# EAGLE board EEZ DIB AFE3 r1B4 (EAGLE 7.2.0)
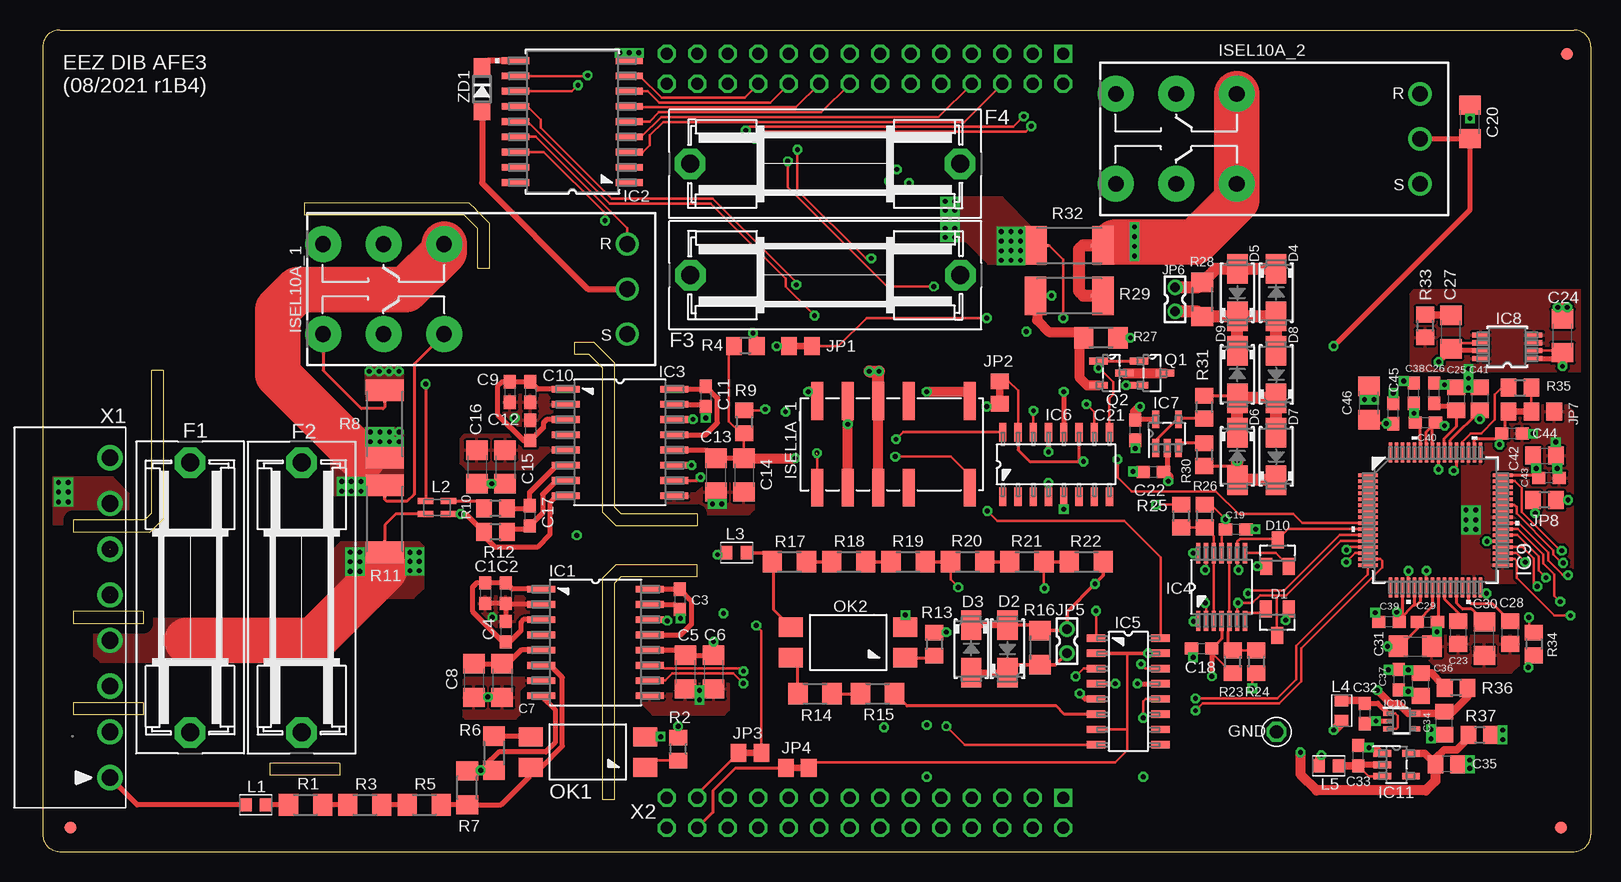
[diagram p4: board, top side]
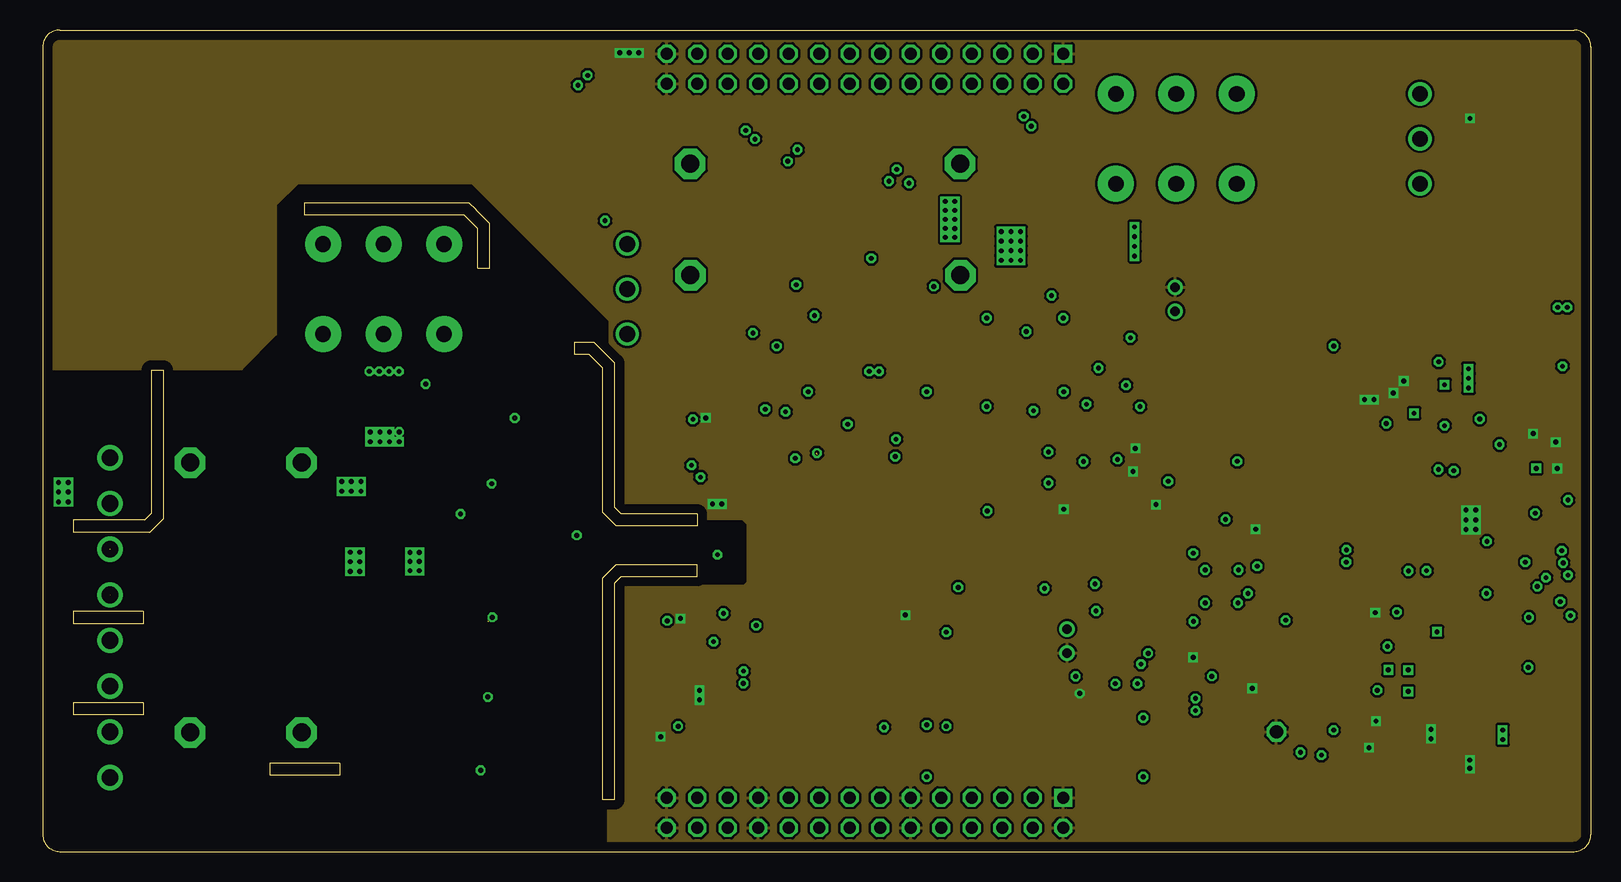
[diagram p5: board, inner layer Gnd]
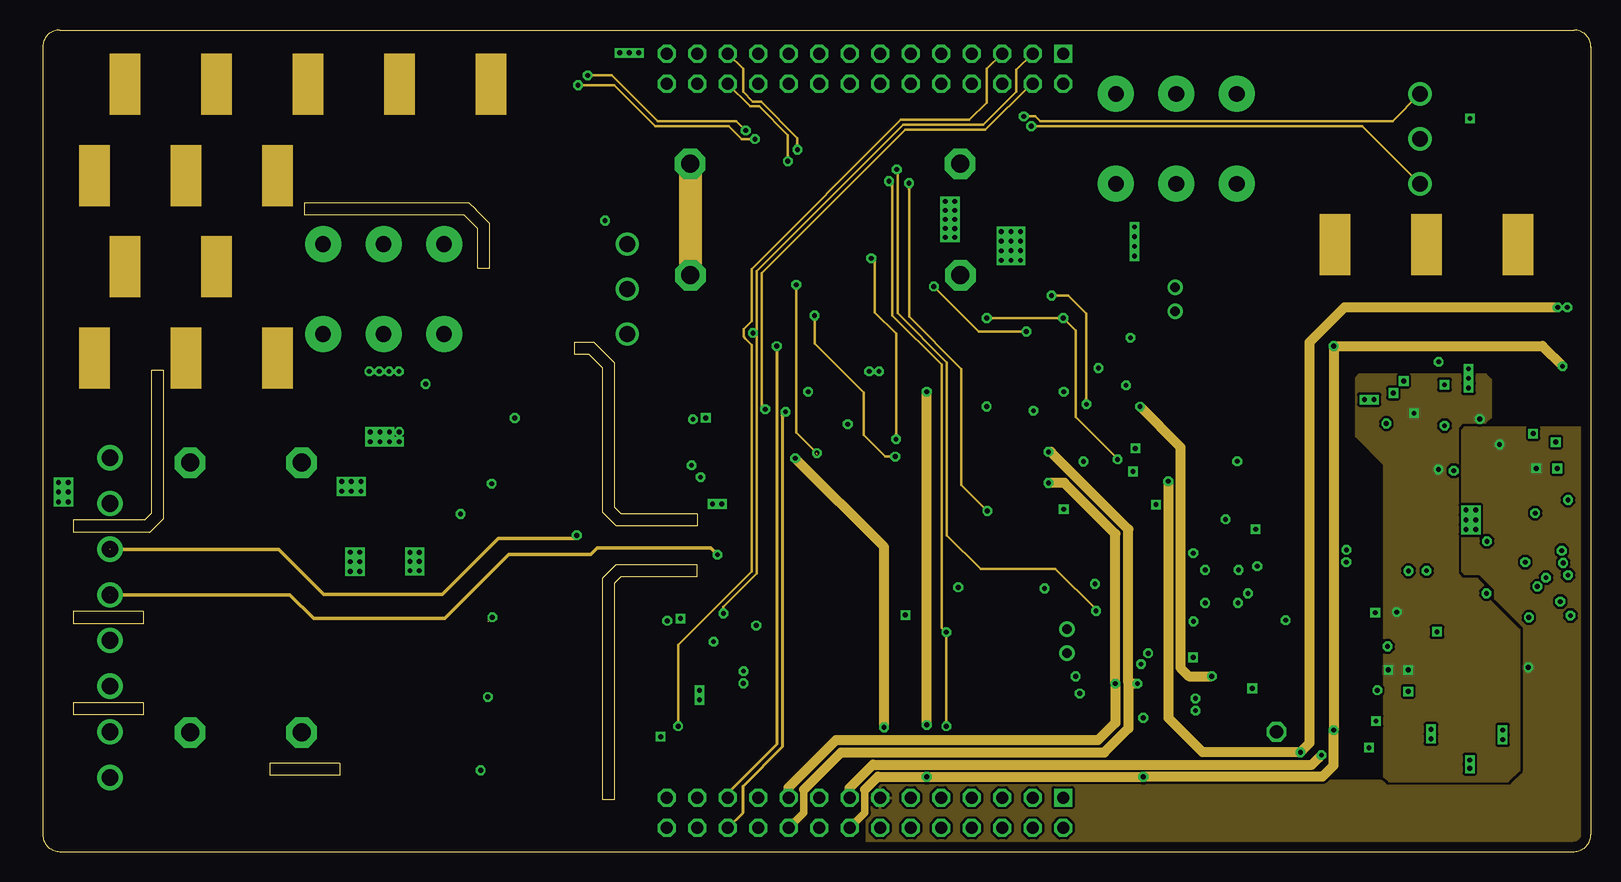
[diagram p6: board, inner layer Power]
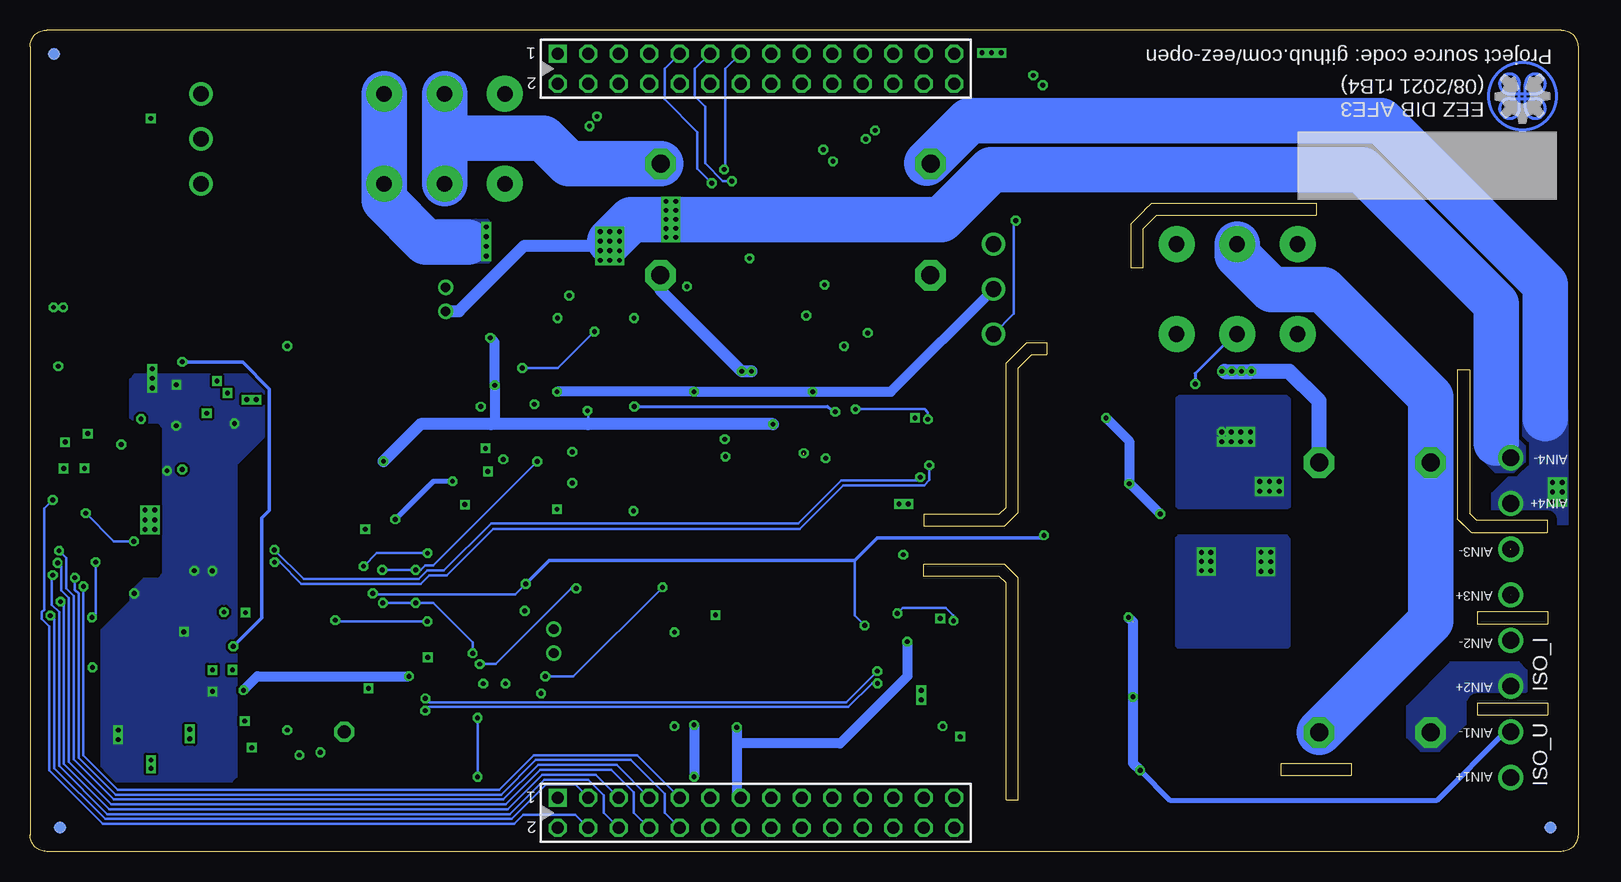
[diagram p7: board, bottom side, seen from below]

Size 129 x 68.5 mm. Coordinates in mm from the lower left corner, seen from the top.
Outline: 36.11,53.5 35.53,54.07 21.81,54.07 21.81,53.06 35.1,53.06 36.23,51.93 36.23,48.66 37.25,48.66 37.25,52.36 36.12,53.49
Outline: 46.52,41.87 45.95,42.44 44.28,42.44 44.28,41.42 45.52,41.42 46.65,40.29 46.65,28.27 47.78,27.14 54.53,27.14 54.53,28.15 48.21,28.15 47.66,28.7 47.66,40.73 46.53,41.86
Outline: 9.28,26.98 9.83,27.53
Outline: 0,67.1 0,1.4 arc90 1.4,0 127.6,0 arc90 129,1.4 129,67.1 arc90 127.6,68.5 1.4,68.5 arc90 0,67.1
Outline: 8.38,20.01 2.54,20.01 2.54,19 8.38,19 8.38,20.01
Outline: 8.38,12.4 2.54,12.4 2.54,11.39 8.38,11.39 8.38,12.4
Outline: 9.03,40.14 9.03,28.18 8.48,27.63 2.55,27.63 2.55,26.62 8.91,26.62 10.05,27.75 10.05,40.14 9.03,40.14
Outline: 48.21,22.93 54.53,22.93 54.53,23.95 47.78,23.95 46.65,22.82 46.65,4.3 47.66,4.3 47.66,22.39 48.21,22.93
Outline: 24.75,7.35 18.91,7.35 18.91,6.33 24.75,6.33 24.75,7.35
Copper layers (1+2+15+16): Top 0.035559375mm / dielectric 7mil / Gnd 0.03048125mm / dielectric 44mil / Power 0.03048125mm / dielectric 7mil / Bottom 0.035559375mm
Design rules "DIB 4-layer *": minimum track width 6mil, minimum drill 0.3mm, track to track 4mil, track to pad 4mil, pad to pad 4mil, via to via 4mil, smd to smd 4mil, copper to edge 30mil, drill to drill 8mil, minimum pad ring 4mil, minimum via ring 8mil, stop-mask expansion 2.5mil, vias tented up to drill 0.6mm, thermal gap 8mil
Net classes: 0 default: width 0.152 mm, drill 0.3 mm, clearance 0.152 mm; 1 lvds: width 0.152 mm, drill 0.3 mm, clearance 0.152 mm to class 0, clearance 0.152 mm; 2 gnd: width 0.254 mm, drill 0.584 mm, clearance 0.254 mm; 3 diff_in: width 0.254 mm, drill 0.584 mm, clearance 0.203 mm to class 0, clearance 0.203 mm to class 1, clearance 0.203 mm to class 2, clearance 0.203 mm
vRestrict: area 0,34.5 to 21,68.5

## Footprints (pad centres in the part's own frame; a part is rotated, then mirrored left to right if it is on the bottom)
C0603 = smd 1.1 x 1: 1 -0.85,0; 2 0.85,0
C1206 = smd 1.6 x 1.8: 1 -1.4,0; 2 1.4,0
C0805 = smd 1.3 x 1.5: 1 -0.95,0; 2 0.95,0
SOT23 = smd 1 x 1.4: 1 -0.95,-1.1; 2 0.95,-1.1; 3 0,1.1
SMA_NARROW = smd 2.464 x 1.702: 1 -1.981,0; 2 1.981,0
ZH32 = drill 1.5 pad 2.54 octagon: 1 -11.25,0; 2 11.25,0
FIDUCIAL_DUAL = smd 1.016 x 1.016 bottom: B 0,0 | smd 1.016 x 1.016: T 0,0
PCB_SHIELD_TAB = drill 1.1 octagon: 1 0,0
DW16 = smd 2.311 x 0.559: 1 -4.521,4.445; 2 -4.521,3.175; 3 -4.521,1.905; 4 -4.521,0.635; 5 -4.521,-0.635; 6 -4.521,-1.905; 7 -4.521,-3.175; 8 -4.521,-4.445; 9 4.521,-4.445; 10 4.521,-3.175; 11 4.521,-1.905; 12 4.521,-0.635; 13 4.521,0.635; 14 4.521,1.905; 15 4.521,3.175; 16 4.521,4.445
DW18_TEX-M = smd 2.286 x 0.559: 1 -4.737,5.08; 2 -4.737,3.81; 3 -4.737,2.54; 4 -4.737,1.27; 5 -4.737,0; 6 -4.737,-1.27; 7 -4.737,-2.54; 8 -4.737,-3.81; 9 -4.737,-5.08; 10 4.737,-5.08; 11 4.737,-3.81; 12 4.737,-2.54; 13 4.737,-1.27; 14 4.737,0; 15 4.737,1.27; 16 4.737,2.54; 17 4.737,3.81; 18 4.737,5.08
PW(R-PDSO-G14) = smd 1.676 x 0.356: 1 -2.819,1.95; 2 -2.819,1.3; 3 -2.819,0.65; 4 -2.819,0; 5 -2.819,-0.65; 6 -2.819,-1.3; 7 -2.819,-1.95; 8 2.819,-1.95; 9 2.819,-1.3; 10 2.819,-0.65; 11 2.819,0; 12 2.819,0.65; 13 2.819,1.3; 14 2.819,1.95
SO16 = smd 1.549 x 0.61: 1 -2.692,4.445; 2 -2.692,3.175; 3 -2.692,1.905; 4 -2.692,0.635; 5 -2.692,-0.635; 6 -2.692,-1.905; 7 -2.692,-3.175; 8 -2.692,-4.445; 9 2.692,-4.445; 10 2.692,-3.175; 11 2.692,-1.905; 12 2.692,-0.635; 13 2.692,0.635; 14 2.692,1.905; 15 2.692,3.175; 16 2.692,4.445
DBV5 = smd 1.473 x 0.559: 1 -1.194,0.95; 2 -1.194,0; 3 -1.194,-0.95; 4 1.194,-0.95; 5 1.194,0.95
MSOP-8_MS_LIT = smd 1.359 x 0.432: 1 -2.229,0.975; 2 -2.229,0.325; 3 -2.229,-0.325; 4 -2.229,-0.975; 5 2.229,-0.975; 6 2.229,-0.325; 7 2.229,0.325; 8 2.229,0.975
PAG64 = smd 1.664 x 0.279: 1 -5.62,3.75; 2 -5.62,3.25; 3 -5.62,2.75; 4 -5.62,2.25; 5 -5.62,1.75; 6 -5.62,1.25; 7 -5.62,0.75; 8 -5.62,0.25; 9 -5.62,-0.25; 10 -5.62,-0.75; 11 -5.62,-1.25; 12 -5.62,-1.75; 13 -5.62,-2.25; 14 -5.62,-2.75; 15 -5.62,-3.25; 16 -5.62,-3.75; 33 5.62,-3.75; 34 5.62,-3.25; 35 5.62,-2.75; 36 5.62,-2.25; 37 5.62,-1.75; 38 5.62,-1.25; 39 5.62,-0.75; 40 5.62,-0.25; 41 5.62,0.25; 42 5.62,0.75; 43 5.62,1.25; 44 5.62,1.75; 45 5.62,2.25; 46 5.62,2.75; 47 5.62,3.25; 48 5.62,3.75 | smd 0.279 x 1.664: 17 -3.75,-5.62; 18 -3.25,-5.62; 19 -2.75,-5.62; 20 -2.25,-5.62; 21 -1.75,-5.62; 22 -1.25,-5.62; 23 -0.75,-5.62; 24 -0.25,-5.62; 25 0.25,-5.62; 26 0.75,-5.62; 27 1.25,-5.62; 28 1.75,-5.62; 29 2.25,-5.62; 30 2.75,-5.62; 31 3.25,-5.62; 32 3.75,-5.62; 49 3.75,5.62; 50 3.25,5.62; 51 2.75,5.62; 52 2.25,5.62; 53 1.75,5.62; 54 1.25,5.62; 55 0.75,5.62; 56 0.25,5.62; 57 -0.25,5.62; 58 -0.75,5.62; 59 -1.25,5.62; 60 -1.75,5.62; 61 -2.25,5.62; 62 -2.75,5.62; 63 -3.25,5.62; 64 -3.75,5.62
DCK5 = smd 0.85 x 0.4: 1 -1.125,0.65; 2 -1.125,0; 3 -1.125,-0.65; 4 1.125,-0.65; 5 1.125,0.65
G6SK-2F = smd 1 x 3.16: 1 -6.35,-3.62; 3 -1.27,-3.62; 4 1.27,-3.62; 5 3.81,-3.62; 6 6.35,-3.62; 7 6.35,3.62; 8 3.81,3.62; 9 1.27,3.62; 10 -1.27,3.62; 12 -6.35,3.62
RT424FXX = drill 1.3 pad 3: 11 20.3,-3.75; 12 15.26,-3.75; 14 25.34,-3.75; 21 20.3,3.75; 22 15.26,3.75; 24 25.34,3.75 | drill 1.3: A1 0,-3.75; A2 0,3.75; A3 0,0
JP2-0805-NOCUT = smd 1.3 x 1.5: 1 -0.95,0; 2 0.95,0
2MM-2 = drill 0.8 pad 1.27: 1 0,-1; 2 0,1
JP3-0805-CUT2 = smd 1.3 x 1.5: COM 0,0; NC 1.9,0; NO -1.9,0
R_0805 = smd 1.3 x 1.5: 1 -0.95,0; 2 0.95,0
BEAD0603 = smd 1 x 1.1: P$1 -0.85,0; P$2 0.85,0
MURATA_DLW21S = smd 1.3 x 0.5: 1 -0.95,-0.55; 2 0.95,-0.55; 3 0.95,0.55; 4 -0.95,0.55
DIL4-SMD = smd 1.6 x 2: 1 -1.27,-4.77; 2 1.27,-4.77; 3 1.27,4.77; 4 -1.27,4.77
SOT103P240X110-3N = smd 1.524 x 0.559: 1 -1.079,1.016; 2 -1.079,-1.016; 3 1.079,0
R1206 = smd 1.6 x 1.803: 1 -1.422,0; 2 1.422,0
R0805 = smd 1.3 x 1.5: 1 -0.95,0; 2 0.95,0
R_2512-4WIRE = smd 1.8 x 3.2: 1 -2.8,0; 2 2.8,0 | smd 1.27 x 0.254: 1S -2.413,0; 2S 2.413,0
691322310008 = drill 1.4: 1 -13.335,0; 2 -9.525,0; 3 -5.715,0; 4 -1.905,0; 5 1.905,0; 6 5.715,0; 7 9.525,0; 8 13.335,0
TSW-114-07-F-D = drill 1 pad 1.5 square: 1 33.02,0 | drill 1 pad 1.5 octagon: 2 33.02,2.54; 3 30.48,0; 4 30.48,2.54; 5 27.94,0; 6 27.94,2.54; 7 25.4,0; 8 25.4,2.54; 9 22.86,0; 10 22.86,2.54; 11 20.32,0; 12 20.32,2.54; 13 17.78,0; 14 17.78,2.54; 15 15.24,0; 16 15.24,2.54; 17 12.7,0; 18 12.7,2.54; 19 10.16,0; 20 10.16,2.54; 21 7.62,0; 22 7.62,2.54; 23 5.08,0; 24 5.08,2.54; 25 2.54,0; 26 2.54,2.54; 27 0,0; 28 0,2.54
SOD123 = smd 1.4 x 1.4: A 1.9,0; C -1.9,0

## Placement (x,y rotation side)
C1  1u  [C0603]  36.88,21.54 270 top
C2  1n  [C0603]  38.6,21.54 270 top
C3  100n  [C0603]  53.06,21.03 270 top
C4  100n  [C0603]  38.6,18.34 270 top
C5  1n  [C1206]  53.54,14.97 270 top
C6  1u  [C1206]  55.89,14.97 270 top
C7  100n  [C1206]  38.28,14.26 270 top
C8  1n  [C1206]  35.93,14.26 270 top
C9  1u  [C0603]  38.91,38.31 270 top
C10  1n  [C0603]  40.63,38.31 270 top
C11  100n  [C0603]  55.24,37.94 270 top
C12  100n  [C0603]  40.63,35.11 270 top
C13  1n  [C1206]  56.08,31.39 270 top
C14  1u  [C1206]  58.43,31.39 270 top
C15  100n  [C1206]  38.53,32.06 270 top
C16  1n  [C1206]  36.18,32.06 270 top
C17  8n2  [C0603]  40.56,27.99 270 top
C18  100n  [C0603]  96.57,16.93 0 top
C19  100n  [C0603]  99.42,26.86 180 top
C20  10u  [C1206]  118.94,60.83 90 top
C21  100n  [C0603]  91.03,35.14 90 top
C22  100n  [C0603]  92.54,31.66 0 top
C23  1u  [C0805]  117.97,18.26 90 top
C24  N.C.  [C1206]  126.64,43.01 90 top
C25  1u  [C0805]  117.79,37.75 270 top
C26  100n  [C0603]  115.95,38.22 90 top
C27  N.C.  [C1206]  117.35,43.32 90 top
C28  1u  [C0805]  122.29,18.26 90 top
C29  100n  [C0603]  115.38,19.15 0 top
C30  22u  [C1206]  120.13,17.75 90 top
C31  10u  [C1206]  114.36,17.12 0 top
C32  100n  [C0603]  110.16,11.52 270 top
C33  100n  [C0603]  109.64,8 90 top
C34  1u  [C0805]  116.79,10.7 90 top
C35  1u  [C0805]  117.01,7.29 180 top
C36  1u  [C0805]  114.82,13.93 90 top
C37  100n  [C0603]  112.98,14.34 270 top
C38  100n  [C0603]  114.25,38.22 90 top
C39  100n  [C0603]  112.18,19.15 180 top
C40  100n  [C0603]  115.21,35.76 0 top
C41  1u  [C0805]  119.75,37.75 270 top
C42  1u  [C0805]  125.15,33 0 top
C43  100n  [C0603]  125.51,31.16 180 top
C44  100n  [C0603]  122.43,34.85 180 top
C45  100n  [C0603]  112.55,36.52 90 top
C46  10u  [C1206]  110.52,37.4 90 top
D1  BAV199,235  [SOT23]  102.87,19.12 180 top
D2  SA2M-E3/61T  [SMA_NARROW]  80.39,16.9 90 top
D3  SA2M-E3/61T  [SMA_NARROW]  77.37,16.9 270 top
D4  SA2M-E3/61T  [SMA_NARROW]  102.78,46.59 270 top
D5  SA2M-E3/61T  [SMA_NARROW]  99.54,46.59 90 top
D6  SA2M-E3/61T  [SMA_NARROW]  99.54,32.95 270 top
D7  SA2M-E3/61T  [SMA_NARROW]  102.78,32.95 90 top
D8  SA2M-E3/61T  [SMA_NARROW]  102.78,39.79 90 top
D9  SA2M-E3/61T  [SMA_NARROW]  99.54,39.79 270 top
D10  BAV199,235  [SOT23]  102.9,24.88 0 top
EEZ_SIGNATURE  SIGNATURESMALL  [SIGNATURE_5MM]  4.63,62.98 180 top
F1  ZH32 (10A)  [ZH32]  12.28,21.18 270 top
F2  ZH32 (1.25A)  [ZH32]  21.58,21.18 90 top
F3  ZH32 (1.25A)  [ZH32]  65.21,48.05 180 top
F4  ZH32 (10A)  [ZH32]  65.2,57.34 180 top
FM1  FIDUCIAL_2  [FIDUCIAL_DUAL]  2.3,2 0 top
FM2  FIDUCIAL_2  [FIDUCIAL_DUAL]  127,66.5 0 top
FM3  FIDUCIAL_2  [FIDUCIAL_DUAL]  126.5,2 0 top
GND  [PCB_SHIELD_TAB]  102.81,9.98 0 top
IC1  AMC3330QDWERQ1  [DW16]  46.06,17.43 0 top
IC2  ULN2803ADWR  [DW18_TEX-M]  44.13,60.86 180 top
IC3  AMC3301DWER  [DW16]  48.09,34.11 0 top
IC4  MCP6004T-I/ST  [PW(R-PDSO-G14)]  98.23,22.06 90 top
IC5  DG212BDY-T1-E3  [SO16]  90.46,13.36 0 top
IC6  DG212BDY-T1-E3  [SO16]  84.44,32.28 90 top
IC7  MCP6001T-I/OT  [DBV5]  93.7,34.85 90 top
IC8  N.C.  [MSOP-8_MS_LIT]  122.05,42.08 180 top
IC9  ADS131E04IPAGR  [PAG64]  116.05,27.63 0 top
IC10  TPS71725DCKR  [DCK5]  113.23,10.87 0 top
IC11  TPS72325DBVR  [DBV5]  112.81,7.24 0 top
ISEL1A_1  EE2-5TNU-L  [G6SK-2F]  70.89,33.96 180 top
ISEL10A_1  RT424F05  [RT424FXX]  48.7,46.9 180 top
ISEL10A_2  RT424F05  [RT424FXX]  114.76,59.43 180 top
JP1  JP2-NOCUT-0805  [JP2-0805-NOCUT]  63.14,42.14 180 top
JP2  JP2-NOCUT-0805  [JP2-0805-NOCUT]  79.76,38.27 90 top
JP3  JP2-NOCUT-0805  [JP2-0805-NOCUT]  58.93,8.21 180 top
JP4  JP2-NOCUT-0805  [JP2-0805-NOCUT]  62.88,6.99 0 top
JP5  DS1025-01-1*2P8BV1-B  [2MM-2]  85.36,17.55 180 top
JP6  DS1025-01-1*2P8BV1-B  [2MM-2]  94.36,46.05 0 top
JP7  JP3-CUT-0805-ROTATED  [JP3-0805-CUT2]  124.05,36.69 180 top
JP8  JP2-CUT-0805  [R_0805]  125.15,29.31 180 top
L1  MLZ1608N100LT000  [BEAD0603]  17.74,3.9 180 top
L2  DLW21SN371SQ2L  [MURATA_DLW21S]  32.84,28.69 0 top
L3  MLZ1608N100LT000  [BEAD0603]  57.82,24.91 180 top
L4  BLM18AG102SH1D  [BEAD0603]  108.23,11.76 270 top
L5  BLM18AG102SH1D  [BEAD0603]  107.16,7.15 180 top
OK1  VOR1142B4  [DIL4-SMD]  45.42,8.3 90 top
OK2  VOR1142B4  [DIL4-SMD]  67.12,17.43 90 top
Q1  BSS214NH6327XTSA1  [SOT103P240X110-3N]  92.43,39.89 0 top
Q2  BSS214NH6327XTSA1  [SOT103P240X110-3N]  89.05,39.89 0 top
R1  1M5 0.1%  [R1206]  21.89,3.9 180 top
R2  470R  [R0805]  52.95,8.54 90 top
R3  1M5 0.1%  [R1206]  26.84,3.9 180 top
R4  N.C.  [R0805]  58.55,42.16 180 top
R5  1M5 0.1%  [R1206]  31.79,3.9 180 top
R6  10K5 0.1%  [R1206]  37.6,8.2 90 top
R7  82K5 0.1%  [R1206]  35.37,5.32 270 top
R8  GMR100HTBFIR022  [R_2512-4WIRE]  28.5,35.66 90 top
R9  N.C.  [R0805]  58.45,35.84 270 top
R10  10R  [R0805]  37.73,28.61 180 top
R11  GMR100HTBFA10L0  [R_2512-4WIRE]  28.5,27.73 90 top
R12  10R  [R0805]  37.73,26.64 180 top
R13  470R  [R0805]  74.3,17.29 270 top
R14  49K9  [R1206]  64.35,13.17 180 top
R15  49K9  [R1206]  69.56,13.17 180 top
R16  100K  [R1206]  83.11,17 90 top
R17  4M7 0.1%  [R1206]  62.22,24.15 180 top
R18  4M7 0.1%  [R1206]  67.16,24.15 180 top
R19  100K 0.1%  [R1206]  72.11,24.15 180 top
R20  200K 0.1%  [R1206]  77.06,24.15 180 top
R21  200K 0.1%  [R1206]  82,24.15 180 top
R22  100K 0.1%  [R1206]  86.96,24.15 180 top
R23  330R  [R0805]  99.16,15.82 90 top
R24  10K  [R0805]  101.13,15.82 270 top
R25  10K  [R0805]  94.86,27.97 270 top
R26  330R  [R0805]  96.82,27.97 90 top
R27  33R  [R1206]  88.18,42.83 0 top
R28  100K  [R1206]  96.62,46.03 270 top
R29  GMR100HTBFIR022  [R_2512-4WIRE]  85.53,46.34 180 top
R30  10K  [R0805]  96.79,33.09 270 top
R31  1K  [R0805]  96.8,37.06 90 top
R32  GMR100HTBFA10L0  [R_2512-4WIRE]  85.55,50.53 0 top
R33  N.C.  [R0805]  115.19,43.82 270 top
R34  10K  [R0805]  124.26,17.31 270 top
R35  10K  [R0805]  123.1,38.67 0 top
R36  10R  [R0805]  117.78,13.66 180 top
R37  10R  [R0805]  119.75,9.71 180 top
X1  691322310008  [691322310008]  5.6,19.5 90 top
X2  DS1023-2*14S21  [TSW-114-07-F-D]  52,4.5 180 bottom
X3  DS1023-2*14S21  [TSW-114-07-F-D]  52,66.54 180 bottom
ZD1  MMSZ5230BT1G  [SOD123]  36.6,63.56 270 top

## Tracks (layer width: path | path; a pad name or v marks a point on that pad's centre or on a via)
!ADC_CS  (via drill 0.4)
  Top 0.203: IC9.39 122.92,26.89 125.06,24.76 125.06,24.04 125.97,23.12 125.97,21.32 v126.45,20.84
  Bottom 0.203: X2.5 81.84,6.4 86.32,6.4 89.19,3.53 122.39,3.53 126.17,7.31 126.17,20.56 v126.45,20.84
!ADC_DRDY  (via drill 0.4)
  Top 0.203: IC9.47 122.67,30.88 123.23,30.32 123.23,28.33 126.48,25.08 v126.58,25.08
  Bottom 0.203: X2.7 80.12,7.22 86.67,7.22 89.55,4.34 122.03,4.34 125.36,7.67 125.36,21.33 125.98,21.95 125.98,24.48 v126.58,25.08
!RESET  (via drill 0.4)
  Top 0.203: IC9.36 123.28,25.39 124.24,24.43 124.24,22.35 v124.55,22.11
  Bottom 0.203: X2.9 78.4,8.04 87.02,8.04 89.9,5.15 121.69,5.15 124.55,8.01 v124.55,22.11
+2V5_ADC  (via drill 0.4)
  Top 0.203: 113.3,19.47 113.3,19.42 C39.1 | v112.84,19.96 113.26,19.96 113.3,20
  Top 0.254: IC9.54 117.3,34.29 119.75,36.74 | C41.2 119.75,36.74 | IC9.59 114.8,35.32 C40.1 | IC9.22 114.8,20.87 114.48,20.55 114.31,20.55 | IC9.21 114.3,20.55 114.31,20.55 | IC9.19 113.3,20 113.3,19.47 | 119.75,36.74 v119.75,36.06 | IC9.56 v116.3,31.85 v116.31,31.85 | 114.31,20.55 114.25,20.55 113.03,19.32 C39.1
  Top 0.305: 112.97,15.2 C37.1 114.51,15.19 | C36.2 114.51,15.19 | 114.51,15.19 114.46,15.13 v113.79,15.13 | 114.36,37.26 114.28,37.17 v114.28,36.53
  Top 0.406: C38.1 114.36,37.26 C40.1
  Top 0.61: C36.2 115.75,14.88 R36.2
  other vias: 112.13,15.15
  pour Power (isolate 0.203): 120.66,39.35 120.66,36.2 120.22,35.76 118.33,35.76 117.89,35.33 117.89,23.17 118.33,22.74 119.52,22.74 120.61,21.65 120.61,20.89 123.04,18.46 123.04,6.79 122.09,5.84 112.19,5.84 111.8,6.23 111.8,32.24 109.44,34.6 109.44,39.48 109.72,39.76 120.26,39.76
+2V5_ISO  (via drill 0.4)
  Top 0.203: R23.1 99.11,14.87 97.54,16.44 97.42,16.33
  Top 0.254: IC4.4 98.23,17.74 C18.2
  Top 0.406: C18.2 97.42,16.33 v97.42,14.62 v97.42,14.61 | IC7.5 91.08,36.04 C21.2
  Top 0.61: v111.21,13.45 112.34,12.32 112.98,12.32 113.78,11.52 IC10.5 116.65,11.52 C34.2 117.5,11.65 118.73,12.88 R36.1
  Top 0.813: C21.2 91.03,36.69 v91.44,37.09
  Power 0.813: v97.42,14.61 95.5,14.61 94.81,15.31 94.81,33.73 v91.44,37.09
  Bottom 0.813: v111.21,13.45 110.05,14.61 v97.42,14.61
+3V3_ISO  (via drill 0.4)
  Top 0.203: 124.44,31.38 124.46,31.4 v124.46,31.95 | R34.2 123.8,15.9 v123.8,15.35 | C14.1 58.43,34.87 R9.2 58.15,34.89 57.16,35.87 57.16,41.56 57.6,42 R4.2
  Top 0.254: IC9.50 119.3,34.28 119.44,34.43 121.4,34.43 | 123.91,33.29 C42.1 123.98,32.79 v124.46,31.95 | IC9.48 124.44,31.38 C43.2 | 121.4,34.43 121.49,34.43 C44.2 121.84,34.85 121.84,36.62 122.15,36.62 JP7.NC | v121.4,33.94 121.4,34.43
  Top 0.406: IC3.12 55.4,33.47 C13.1 C14.1 | IC1.12 53.11,16.8 C5.1 C6.1
  Top 0.813: C14.1 v62.7,32.79 | C6.1 v55.89,17.5
  Power 0.813: v70.1,10.36 70.1,25.38 v62.7,32.79
  Bottom 0.813: v70.1,10.36 70.1,9.01 | 70.1,9.01 70.1,4.82 X2.13 | v55.89,17.5 55.89,14.61 61.49,9.01 70.1,9.01
  pour Power (isolate 0.203, rank 2): 68.64,0.49 68.64,4.87 69.66,5.89 122.56,5.89 123.44,6.78 123.44,18.65 121.03,21.07 121.03,21.83 119.7,23.16 118.49,23.16 118.3,23.35 118.3,35.16 118.49,35.35 128.7,35.35 128.7,1 128.13,0.43 68.71,0.43
+5V_ISO  (via drill 0.4)
  Top 0.203: 93.57,12.72 IC5.12 91.92,12.72 91.71,12.51 v91.71,11.15 | IC8.2 126.5,41.76 C24.1
  Top 0.406: 77.19,37.63 ISEL1A_1.1 | v85.08,38.34 IC6.12 | ISEL10A_2.A3 C20.1 118.94,53.51 v107.57,42.15 | IC8.1 126.14,41.11 C24.1
  Top 0.508: ZD1.A 36.6,55.74 45.43,46.91 ISEL10A_1.A3
  Top 0.813: L4.P$2 108.23,10.78 v107.57,10.12 | v126.64,40.46 C24.1 | ISEL1A_1.6 64.54,38.31 64.57,38.34 v63.78,38.34 | v73.66,38.34 77.19,38.34 77.24,38.29 ISEL1A_1.1
  Power 0.61: 68.52,5.15 68.52,3.24 X2.16
  Power 0.813: 68.52,5.15 69.6,6.23 v73.66,6.23 v91.71,6.23 106.63,6.23 107.57,7.17 v107.57,10.12 v107.57,42.15 124.95,42.15 v126.64,40.46 | v73.66,10.55 v73.66,38.34
  Bottom 0.203: v91.71,11.15 v91.71,6.23
  Bottom 0.813: v85.08,38.34 v73.66,38.34 v63.78,38.34 57.26,38.34 ISEL10A_1.A3 | v73.66,10.55 v73.66,6.23
+15V_ISO  (via drill 0.4)
  Top 0.406: v91.22,13.99 IC5.13 | IC6.13 v83.81,33.32
  Power 0.61: X2.20 63.42,3.22 63.42,5.15
  Power 0.813: 63.42,5.15 66.53,8.26 88.47,8.26 90.46,10.26 90.46,14.04 | 90.46,14.04 90.46,26.86 84,33.32 v83.81,33.32 | v91.22,13.99 90.51,13.99 90.46,14.04
-2V5_ISO  (via drill 0.4)
  Top 0.203: R26.2 97.33,28.93 v98.56,27.7 | IC4.11 98.23,26.53 C19.2
  Top 0.254: 98.53,26.82 C19.2
  Top 0.406: IC7.2 93.7,31.96 C22.2 | v98.56,27.7 C19.2
  Top 0.61: R37.2 118.82,9.47 117.84,8.49 116.78,8.49 116.06,7.77 C35.2 115.16,8.19 IC11.5
  Top 0.813: C35.2 116.06,5.89 115.27,5.1 106.15,5.1 104.8,6.45 v104.8,8.28 | C22.2 93.79,31.26 v93.79,30.87 | v126.24,45.37 v127.04,45.37 126.64,44.98 C24.2
  Power 0.813: v93.79,30.87 93.79,11.13 96.65,8.28 v104.8,8.28 105.55,9.03 105.55,42.45 108.47,45.37 v126.24,45.37
  Bottom 0.406: v93.79,30.87 95.39,30.87 v98.56,27.7
-5V_ISO  (via drill 0.4)
  Top 0.61: L5.P$2 106.31,7.79 v106.55,8.04
  Power 0.813: X2.15 67.24,5.31 69.18,7.25 105.77,7.25 v106.55,8.04
-15V_ISO  (via drill 0.4)
  Top 0.406: v83.81,30.73 IC6.4 | IC5.4 v89.38,13.99
  Power 0.813: X2.19 62.16,5.34 66.12,9.29 87.95,9.29 89.38,10.73 v89.38,13.99 89.38,26.49 85.14,30.73 v83.81,30.73
ADC_CLK  (via drill 0.4)
  Top 0.203: v127.1,29.31 JP8.1
  Bottom 0.203: X2.4 83.58,3.07 87.9,3.07 88.66,2.31 122.92,2.31 127.39,6.78 127.39,18.75 128.02,19.38 128.02,19.96 127.83,20.15 127.83,28.58 v127.1,29.31
ADC_MISO  (via drill 0.4)
  Top 0.203: IC9.43 122.64,28.88 122.81,28.71 122.81,28.18 125.87,25.12 125.87,24.79 126.59,24.06 v126.69,24.06
  Bottom 0.203: X2.8 78.68,3.24 78.68,4.95 80.54,6.82 86.49,6.82 89.37,3.93 122.21,3.93 125.77,7.49 125.77,21.16 126.39,21.78 126.39,23.76 v126.69,24.06
ADC_MOSI  (via drill 0.4)
  Top 0.203: IC9.34 122.68,24.38 122.82,24.24 122.82,22.81 125.96,19.67 v127.31,19.67
  Bottom 0.203: X2.3 82.48,4.51 83.55,5.58 85.97,5.58 88.84,2.71 122.75,2.71 126.99,6.96 126.99,19.35 v127.31,19.67
ADC_SCK  (via drill 0.4)
  Top 0.203: IC9.40 123.01,27.39 125.46,24.94 125.46,24.27 126.68,23.05 v127.1,23.05
  Bottom 0.203: X2.6 81.2,3.22 81.2,4.7 82.5,5.99 86.14,5.99 89.01,3.12 122.57,3.12 126.58,7.13 126.58,19.96 127.18,20.56 127.18,22.97 v127.1,23.05
ADC_START  (via drill 0.4)
  Top 0.203: IC9.38 122.85,26.39 124.65,24.6 124.65,23.44 v125.26,22.83
  Bottom 0.203: X2.10 76.11,3.21 76.11,4.8 78.94,7.63 86.84,7.63 89.72,4.75 121.87,4.75 124.95,7.83 124.95,21.51 125.26,21.82 v125.26,22.83
AIN1N  (via drill 0.4)  (1 unrouted)
  Top 0.406: IC1.2 38.67,20.61 C2.2 | C2.2 C4.1 | C2.2 C1.2 | IC1.8 42.69,11.85 42.69,9.06 41.92,8.3 38.02,8.3 36.85,7.13 | 36.85,7.13 v36.49,6.77 36.46,6.74 R7.1 | R6.1 37.2,6.78 36.85,7.13
  Top 0.813: 37.06,12.86 v37.08,12.89 | C8.2 35.96,12.89 | 35.96,12.89 v37.08,12.89 | 35.96,12.89 35.74,12.89 35.48,12.63 | C7.2 37.11,12.86 v37.09,12.88 v37.08,12.89
  Bottom 0.406: X1.2 6.05,9.97 11.79,4.24 33.96,4.24 v36.49,6.77
  Bottom 0.813: 37.11,19.18 v37.47,19.53 | v36.49,6.77 37.09,7.37 v37.09,12.88 37.09,19.15
  pour Top (isolate 0.203): 36.16,21.26 40.03,21.26 40.47,20.81 40.47,19.3 39.55,19.3 38.99,18.74 37.22,18.74 36.16,19.81
  pour Top (isolate 0.203): 41.74,14.49 35.24,14.49 35.06,14.31 35.06,11.25 35.22,11.1 39.4,11.1 39.71,11.41 39.71,13.4 40.4,14.08 41.74,14.08
AIN1P
  Top 0.406: L1.P$2 7.87,3.9 X1.1
AIN2N  (via drill 0.4)
  Top 0.203: 28.5,24.81 R11.1 | 28.51,23.52 28.51,24.93
  Top 3.81: 11.98,17.6 11.98,17.59 22.59,17.59 28.51,23.52
  other vias: 25.62,24.95 26.42,24.95 25.62,24.16 26.42,24.16 25.62,23.36 26.42,23.36 30.61,24.94 31.37,24.94 30.61,24.18 31.37,24.18 30.61,23.42 31.37,23.42
  pour Top (isolate 0.457, no thermals): 12.31,15.8 4.81,15.8 4.28,16.33 4.28,18.88 4.32,18.92 7.89,18.92 8.31,19.34 8.36,19.39 12.26,19.39 12.31,19.34
  pour Top (isolate 0.254, no thermals): 30.86,21.13 31.69,21.95 31.69,25.45 31.37,25.77 24.83,25.77 24.13,25.07 24.13,21.36 28.44,21.13
  pour Bottom: 24.32,26.34 33.27,26.34 33.46,26.15 33.46,17.13 33.34,17 24.19,17 24.07,17.13 24.07,26.08
AIN2P
  pour Bottom (isolate 0.254, no thermals): 4.84,12.84 9.07,12.84 9.39,12.52 9.39,10.59 11.58,8.39 13.11,8.39 14.25,9.53 14.25,12.11 10.6,15.76 4.95,15.76 4.31,15.11 4.31,13.37
AIN3/20  (via drill 0.4)
  Top 0.203: IC5.3 86.73,15.26 v86.07,14.6 | R20.2 75.64,22.68 v76.29,22.03
  Top 0.305: R20.2 R19.1
  Bottom 0.203: v86.07,14.6 83.72,14.6 v76.29,22.03
AIN3P
  Top 0.254: OK2.3 60.88,20.17 60.88,24.06 R17.2
  Top 0.305: OK2.3 62.15,18.93 | L3.P$1 60.03,24.91 R17.2
AIN4N  (via drill 0.4)
  Top 0.813: v79.88,49.3 v80.68,49.3 80.37,49.3
  Top 1.016: D5.1 D4.2 D8.2 | D9.1 D5.1 | D5.1 R28.2 | R28.2 | JP6.1 96.19,45.05 R28.2 | R32.1 81.85,50.53 v81.48,50.9
  Bottom 0.406: v79.88,51.69 v80.68,51.69 v80.68,50.9 79.9,50.9 v79.88,50.89 v79.88,50.09 | v79.88,49.3 v79.88,50.09 | v80.68,49.3 v81.48,49.3 v81.48,50.1 v81.48,50.9 | v80.68,50.1 79.9,50.1 v79.88,50.09 | v81.48,51.69 v81.48,50.9 | 81.5,50.81 81.5,50.89 v81.48,50.9
  Bottom 1.016: JP6.1 93.27,45.05 87.8,50.52 81.06,50.52 v80.68,50.9
  Bottom 3.81: 6.81,34.04 6.81,45.65 18.02,56.87 48.91,56.87 51.91,53.86 52.25,53.53 53.07,52.7 78.88,52.7 v80.68,50.9
  other vias: 75.2,54.2 75.2,53.45 75.2,52.7 75.2,51.95 75.2,51.2 76,54.2 76,53.45 76,52.71 76,51.94 76,51.2
  pour Bottom (isolate 0.254, no thermals): 8.61,34.95 8.28,33 6.91,31.63 5.33,31.63 4.45,32.52 4.45,33.82 5,34.38 5,34.95
  pour Top (isolate 0.254, no thermals): 74.92,54.51 79.96,54.51 82.42,52.04 82.42,49.03 78.78,49.03 76.91,50.9 74.93,50.9 74.92,50.91
AIN4P  (via drill 0.4)
  Power 1.93: F4.2 53.95,48.07 F3.2
  Bottom 0.508: F4.2 54.25,57.4 54.13,57.52
  Bottom 3.81: 2.74,36.1 2.74,47.29 16.4,60.94 50.71,60.94 54.13,57.52 54.27,57.39
  other vias: 1.31,30.78 1.31,29.97 1.31,29.16 2.12,30.78 2.12,29.97 2.12,29.16
  pour Bottom (isolate 0.254, rank 2, no thermals): 0.46,36.74 4.55,36.74 4.55,32.45 7.14,29.85 7.14,28.18 6.26,27.3 0.64,27.3 0.46,27.48
  pour Top (isolate 0.254, rank 2, no thermals): 0.46,31.18 5.82,31.18 7.12,29.87 7.12,28.19 6.25,27.31 0.62,27.31 0.44,27.49
AIN4P_FUSED  (via drill 0.4)
  Top 0.813: ISEL1A_1.9 ISEL1A_1.4
  Top 1.016: ISEL1A_1.4 69.62,39.98 v69.69,40.04 v68.87,40.04
  Bottom 1.016: F3.1 76.47,46.82 v69.69,40.04 v68.87,40.04
AVSS  (via drill 0.4)
  Top 0.203: v120.31,21.52 119.84,21.52 119.81,21.5 119.81,22 IC9.32 | C41.1 | C26.2 116.65,39.07 v116.8,38.92 117.02,38.7 C25.1 | C29.2 116.23,18.37 v116.18,18.32 116.18,17.53 C31.2
  Top 0.254: IC9.25 116.3,19.67 | 116.3,19.67 116.3,19.22 C29.2 | 115.9,19.27 116.3,19.67 | C45.1 111.99,35.66 v111.96,35.68 111.03,35.68 C46.1 | IC9.57 115.8,35.5 C40.2 | v116.81,35.51 116.32,35.51 C40.2 | IC9.58 115.3,35 C40.2 | IC9.20 v113.8,23.4 v113.81,23.4 | IC9.53 117.8,31.97 v117.58,31.75 | IC9.23 115.3,23.4 v115.32,23.42
  Top 0.305: C37.2 113.22,13.24 v113.79,13.34 114.56,13.24 C36.1
  Top 0.406: C41.1 119.36,38.31 v118.81,38.66
  Top 0.61: R37.1 120.94,9.87 v121.65,10.12
  Bottom 0.305: v118.81,40.26 v118.81,39.46
  other vias: 121.65,9.33
  pour Bottom (isolate 0.203): 120.66,39.35 120.66,36.2 120.22,35.76 118.33,35.76 117.89,35.33 117.89,23.17 118.33,22.74 119.52,22.74 120.61,21.65 120.61,20.89 123.04,18.46 123.04,6.79 122.73,6.04 122.53,5.84 112.19,5.84 111.8,6.23 111.8,32.24 109.44,34.6 109.44,39.48 109.72,39.76 120.26,39.76
  pour Top (isolate 0.203): 115.21,17.97 122.99,17.97 122.99,15.52 122.39,14.92 116.57,14.92 115.21,16.28
  pour Top (isolate 0.203): 114.3,46.8 128.14,46.8 128.52,46.42 128.52,40.45 128.14,40.07 114.24,40.07 113.98,40.32 113.98,46.48
DIAG#1  (via drill 0.4)
  Top 0.203: IC1.14 51.94,19.34 v52.05,19.24 | R4.1 59.5,42.92 v59.18,43.24
  Power 0.203: X3.3 81.14,65.2 81.14,63.37 78.37,60.6 71.69,60.6 59.49,48.4 59.49,43.24 | 59.49,43.24 59.49,23.17 56.72,20.41 v56.72,19.86 | v59.18,43.24 59.49,43.24
  Bottom 0.203: v52.05,19.24 52.05,19.67 52.68,20.3 56.27,20.3 v56.72,19.86
DIAG#2  (via drill 0.4)
  Top 0.203: IC3.14 54.15,36.01 v54.18,36.04 | R9.1 60.12,36.79 v60.21,36.88
  Power 0.203: X3.4 82.36,64 78.55,60.2 71.87,60.2 59.91,48.23 59.91,37.18 v60.21,36.88
  Bottom 0.203: v60.21,36.88 60.2,36.89 54.46,36.89 54.18,36.61 v54.18,36.04
GND  (via drill 0.4)
  Top 0.203: v111.04,19.91 111.04,19.44 C39.2 | R25.1 v92.76,28.93 | C22.1 90.87,31.66 v90.84,31.68 | C19.1 101.05,26.86 v101.07,26.87 | C18.1 95.72,16.33 v95.86,16.19 | OK1.2 v51.49,9.57 | v100.79,13.6 100.79,14.53 R24.2 | IC6.5 v85.08,28.55
  Top 0.254: C46.2 110.72,38.08 v110.15,37.68 | C45.2 v112.55,38.24 | OK2.2 v71.89,19.71 v71.88,19.72
  Top 0.305: D2.1 81.05,15.58 R16.1 84.39,15.58 JP5.2
  Top 0.406: IC10.2 v111.1,10.87 110.35,10.87 C32.2 | C38.2 v113.41,39.23 | IC11.1 111.15,8.66 v110.52,8.66 | C20.2 v118.94,61.12 | IC3.15 55.05,37.28 C11.2 v55.24,36.15 | IC1.15 52.63,20.61 C3.2 53.15,20.09 v53.15,19.43 | IC5.5 86.87,12.72 v86.41,13.18 | C21.1 91.03,33.63 v91.05,33.61
  Top 0.508: v48.87,66.6 IC2.9 | D3.2 D2.1
  Top 0.61: C33.2 109.83,8.66 v110.52,8.66 | C34.1 116.03,9.75 v115.68,9.41 | C35.1 118.58,7.29 v118.92,7.63
  Top 1.016: D4.1 D5.2 97.74,48.57 R28.1 96.21,47.05 JP6.2
  other vias: 55.8,28.98 54.72,12.65 56.58,28.98 54.72,13.45 110.93,37.68 118.92,6.93 118.61,26.84 118.61,27.66 118.61,28.47 126.2,31.94 126.07,34.13 124.19,34.85 119.42,27.66 119.42,28.47 119.42,26.84 49.67,66.6 48.07,66.6 115.68,10.18
  pour Top (isolate 0.203, rank 2): 127.5,22.39 118.3,22.39 118.3,34.62 118.97,35.29 119.49,35.29 121.39,37.18 127.04,37.18 127.5,36.73
  pour Top (isolate 0.203): 49.52,13.15 52.36,13.15 53.2,13.99 57.18,13.99 57.18,11.82 56.79,11.44 50.81,11.44 49.52,12.73
  pour Top (isolate 0.203): 51.59,29.84 54.43,29.84 55.27,30.68 59.25,30.68 59.25,28.51 58.86,28.13 52.88,28.13 51.59,29.42
  pour Gnd (isolate 0.203): 47.18,22.15 47.12,0.05 131.19,0.05 131.95,0.81 131.95,67.55 131.13,68.37 0.64,68.37 -0.06,67.67 -0.06,40.31 0,40.24 16.57,40.24 19.43,43.1 19.43,53.9 21.27,55.74 35.75,55.74 47.24,44.24 47.24,28.43 47.94,27.73 58.29,27.73 58.74,27.29 58.74,22.46 58.42,22.15
GNDI1  (via drill 0.4)  (1 unrouted)
  Top 0.406: R12.2 36.59,26.45 | L2.2 v34.81,28.14 35.24,28.14 36.74,26.64 R12.2 | IC3.8 42.88,29.66 42.27,29.05 42.27,26.44 41.2,25.37 37.69,25.37 36.78,26.28 R12.2
  Top 0.813: C15.2 37.44,30.66 v37.4,30.67 C16.2
  Bottom 0.813: 39.32,36.13 37.4,34.21 v37.4,30.67 37.34,30.67 v34.81,28.14
  other vias: 39.33,36.14
  pour Top (isolate 0.203): 38.15,38.05 42.02,38.05 42.47,37.6 42.47,36.09 41.54,36.09 40.98,35.53 39.22,35.53 38.15,36.6
HI_CLAMP
  Top 0.203: IC4.10 IC4.5 | R24.1 R23.2 98.89,17.05
  Top 0.254: 98.89,17.05 98.89,17.04 98.81,16.96 98.81,18.37 98.92,18.49 98.92,19.2 IC4.5
HI_CURR#1  (via drill 0.4)
  Top 0.254: R32.2 88.64,50.82 89.38,50.82
  Top 3.81: ISEL10A_2.12 ISEL10A_2.22 99.5,54.31 96.01,50.82 89.38,50.82
  Bottom 0.203: v90.98,52.08 v90.98,51.27 v90.98,50.45
  Bottom 2.54: 94.73,50.82 94.2,50.82
  Bottom 3.81: ISEL10A_2.12 ISEL10A_2.22 99.5,54.31 96.01,50.82 94.2,50.82 92.52,50.82
  other vias: 90.98,49.64
  pour Bottom (isolate 0.254, no thermals): 95.02,52.63 90.98,52.63 90.86,52.63 90.68,52.45 90.68,49.26 90.82,49.12 94.63,49.12 95.02,49.12
HI_FORCE+  (via drill 0.4)
  Top 3.81: 26.62,32.75 19.58,39.79 19.58,45.17 21.26,46.85 30.25,46.85 33.44,50.04 ISEL10A_1.12
  other vias: 26.52,30.04 25.7,30.04 24.9,30.04 26.52,30.84 25.7,30.84 24.9,30.84 29.69,34.97 28.89,34.97 28.09,34.97 27.29,34.97 29.69,34.17 28.89,34.17 28.09,34.17 27.29,34.17
  pour Top (isolate 0.203, no thermals): 24.04,30.03 24.04,32.79 22.3,34.53 22.29,35.29 29.82,35.28 30,35.1 30,29.73 24.35,29.73
  pour Bottom: 24.3,37.98 33.25,37.98 33.44,37.79 33.44,28.77 33.31,28.65 24.17,28.65 24.04,28.77 24.04,37.73
HI_SENSE+
  Top 0.254: ISEL10A_1.22 30.94,40.64 30.94,29.79 30.34,29.19 28.66,29.19 28.5,29.36 R11.2S 28.5,30.27
IN1N  (via drill 0.4)
  Top 0.203: IC1.10 51.87,14.26 52.46,14.86 57.54,14.86 v58.38,14.02 | IC9.15 111.45,24.38 111.61,24.23 111.61,23.67 104.86,16.93 104.86,14.18 103.03,12.35 96.67,12.35 v96.06,11.74
  Bottom 0.203: v96.06,11.74 95.76,12.05 60.8,12.05 58.83,14.02 v58.38,14.02
IN1P  (via drill 0.4)
  Top 0.203: IC1.11 51.58,15.53 51.84,15.26 58.17,15.26 v58.4,15.03 | v96.05,12.76 102.87,12.76 104.46,14.35 104.46,17.13 110.43,23.1 IC9.16
  Bottom 0.203: v96.05,12.76 95.75,12.46 60.97,12.46 v58.4,15.03
IN2N  (via drill 0.4)
  Top 0.203: IC9.13 108.86,25.38 v108.64,25.16
  Top 0.254: IC3.10 54.53,30.93 v54.81,31.21
  Bottom 0.203: v54.81,31.21 v54.81,31.2 55.07,30.95 61.4,30.95 64.99,27.36 90.58,27.36 94.51,23.43 95.9,23.43 96.61,22.72 106.2,22.72 v108.64,25.16
IN2P  (via drill 0.4)
  Top 0.203: IC9.14 109.38,24.88 v108.62,24.13
  Top 0.254: v54.06,32.2 IC3.11
  Bottom 0.203: v54.06,32.2 54.06,30.96 54.5,30.53 61.24,30.53 64.86,26.91 90.39,26.91 94.28,23.01 95.73,23.01 96.43,22.31 106.39,22.31 108.2,24.13 v108.62,24.13
IN3N  (via drill 0.4)  (1 unrouted)
  Top 0.203: v100.43,21.52 100.67,21.77 103.45,21.77 108.07,26.38 IC9.11 | JP3.1 59.88,18.41 v59.45,18.84
  Top 0.305: D2.2 82.65,18.88 R16.2 85.23,18.42 JP5.1 85.36,19.99 v87.68,22.31 88.38,23.01 R22.1
  Top 0.508: D3.1 D2.2
  Power 0.305: X1.6 19.65,25.21 23.41,21.45 33.3,21.45 37.97,26.12 44.26,26.12 v44.5,26.36
  Bottom 0.203: v100.43,21.52 100.34,21.43 88.56,21.43 v87.68,22.31 | 60.29,24.27 60.29,19.68 v59.45,18.84
  Bottom 0.305: v44.5,26.36 44.7,26.16 58.4,26.16 60.29,24.27 85.72,24.27 v87.68,22.31
IN3P  (via drill 0.4)
  Top 0.203: v92.11,16.53 IC5.15 | IC4.6 99.53,20.66 v99.59,20.72 100.8,20.72 101.44,21.36 102.82,21.36 | IC4.2 96.93,20.65 v96.86,20.72 | D1.3 102.76,18.02 102.76,18.03 102.82,18.09 102.82,21.36 | 102.82,21.36 103.63,21.36 108.16,25.88 IC9.12 | IC5.7 90.35,10.18 90.36,10.2 | 90.36,10.2 90.36,8.42 89.37,7.43 64.22,7.43 63.83,7.03 JP4.2 | 90.36,10.2 90.36,16.46 90.44,16.53
  Top 0.305: IC5.2 90.44,16.53 v92.11,16.53
  Bottom 0.203: v99.59,20.72 v96.86,20.72 95.39,20.72 92.11,17.45 v92.11,16.53
IN4N  (via drill 0.4)
  Top 0.203: IC9.9 104.95,27.38 104.19,28.14 99.66,28.14 97.77,30.03 90.73,30.03 89.56,31.2 v89.56,32.7 | R32.1S 83.88,50.53 85.04,49.37 v85.04,44.48 | v78.66,44.48 68.64,44.48 66.29,42.13 JP1.1
  Power 0.203: v89.56,32.7 89.56,32.75 86.08,36.23 86.08,43.44 v85.04,44.48 v78.66,44.48
IN4P  (via drill 0.4)
  Top 0.203: IC4.13 96.93,23.55 v96.86,23.48 | v99.64,23.48 99.53,23.59 IC4.9 99.54,24.88 99.54,25.84 99.77,26.07 102.8,26.07 D10.3 103.8,26.88 IC9.10 | 86.35,32.53 v86.72,32.53 | IC6.15 81.27,38.43 80.45,39.24 79.77,39.24 JP2.2
  Top 0.254: IC6.11 86.35,32.53 86.33,32.52 82.23,32.52 81.27,33.49 IC6.15
  Bottom 0.203: v99.64,23.48 v96.86,23.48 96.44,23.48 96.06,23.86 95.39,23.86 v86.72,32.53
ISEL10_R#4
  Top 0.203: IC2.8 49.76,64.66 51.56,62.86 58.48,62.86 X3.22
ISEL10_S#4
  Top 0.203: IC2.7 50.43,63.4 51.37,62.45 60.62,62.45 X3.20
ISEL10A_R4_OUT  (via drill 0.4)
  Top 0.203: IC2.11 45.35,64.66 v45.4,64.72 | v58.57,60.12 58.88,60.42 80.87,60.42 v81.75,61.3
  Power 0.203: v45.4,64.72 47.41,64.72 51.23,60.89 57.8,60.89 v58.57,60.12 | v81.75,61.3 82.72,61.3 83.11,60.91 112.48,60.91 ISEL10A_2.A1
ISEL10A_S4_OUT  (via drill 0.4)
  Top 0.203: IC2.12 44.09,63.4 v44.6,63.9 | v59.35,59.41 59.96,60.02 81.92,60.02 v82.37,60.47
  Power 0.203: v44.6,63.9 47.64,63.9 51.05,60.49 57.17,60.49 58.26,59.41 v59.35,59.41 | v82.37,60.47 109.97,60.47 ISEL10A_2.A2
ISEL_LOW#4  (via drill 0.4)
  Top 0.203: 80,34.73 IC6.16 71.7,34.97 v71.11,34.38 | v62.89,58.52 62.89,55.14 68.57,49.46 v69.04,49.46
  Power 0.203: X3.23 58.36,65.26 58.36,63.34 59.17,62.53 59.85,62.53 62.89,59.5 v62.89,58.52 | v69.04,49.46 69.34,49.16 69.34,44.95 71.11,43.19 v71.11,34.38
ISEL_MID#4  (via drill 0.4)
  Top 0.203: Q2.1 v87.97,40.32 88.04,40.32 89.22,39.14 89.22,38.11 88.89,37.78 IC6.9 | v62.09,57.55 62.09,55.38 70.36,47.11 v74.26,47.11
  Top 0.254: Q2.1 Q1.1 91.5,40.75
  Power 0.203: v62.09,57.55 62.09,59.73 59.69,62.12 58.95,62.12 X3.24 | v74.26,47.11 v74.26,47.1 78,43.35 v81.97,43.35
  Bottom 0.203: v87.97,40.32 85,40.32 v81.97,43.35
ISEL_R2_OUT
  Top 0.203: IC2.15 41.1,59.59 48.7,51.98 ISEL10A_1.A1
ISEL_R4_OUT  (via drill 0.4)  (1 unrouted)
  Top 0.203: IC2.13 40.39,62.14 41.52,61.01 41.52,60.33 47.41,54.44 55.83,54.44 62.79,47.48 v62.79,47.25 | ISEL1A_1.7 64.54,33.12
  Power 0.203: v64.52,33.22 62.79,34.95 v62.79,47.25
ISEL_R#2
  Top 0.203: IC2.4 49.87,59.59 51.52,61.24 74.64,61.24 X3.8
ISEL_R#4
  Top 0.203: IC2.6 48.95,62.05 62.75,62.05 X3.18
ISEL_S2_OUT  (via drill 0.4)
  Top 0.203: IC2.16 41.76,58.31 46.85,53.22 v46.85,52.6
  Bottom 0.203: ISEL10A_1.A2 47,44.85 47,52.45 v46.85,52.6
ISEL_S4_OUT  (via drill 0.4)
  Top 0.203: IC2.14 40.41,60.85 47.23,54.03 55.65,54.03 61.91,47.77 61.91,47.1 64.31,44.7 v64.31,44.69 | ISEL1A_1.12 77.24,31.37 75.68,32.93 v71.04,32.93
  Power 0.203: v71.04,32.93 70.21,32.93 68.42,34.72 68.42,38.26 64.31,42.36 v64.31,44.69
ISEL_S#2
  Top 0.203: IC2.3 49.99,58.31 50.57,58.9 50.57,59.71 51.69,60.83 76.77,60.83 X3.6
ISEL_S#4
  Top 0.203: IC2.5 50.56,60.85 51.35,61.64 64.88,61.64 X3.16
LO_CLAMP
  Top 0.203: R25.2 R26.1 97.58,26.27 IC4.12 IC4.3
LO_FORCE-  (via drill 0.4)
  Bottom 1.27: 29.48,40.04 v27.22,40.04 24.05,40.04 21.58,37.56 F2.2
  other vias: 28.04,40.04 28.85,40.04 29.68,40.04
  pour Top (isolate 0.203, no thermals): 27.1,40.36 29.79,40.36 30,40.15 30,37.65 27.44,37.65 26.9,38.2 26.9,40.15
LOW_SENSE+
  Top 0.254: R8.2S 28.5,37.07 28.36,36.93 26.56,36.93 23.36,40.12 ISEL10A_1.24
N$1
  Top 0.203: IC9.52 118.3,34.16 119.01,34.87 119.86,34.87 121.01,36.01 121.01,38.1 121.58,38.67 R35.1
N$2
  Top 0.406: R1.2 L1.P$1
N$3
  Top 0.203: IC10.3 112.79,10.22 112.93,10.36 112.93,11.3 112.71,11.52 IC10.1
  Top 0.406: C32.1 111.26,12.37 IC10.1
  Top 0.508: C32.1 109.92,12.37
  Top 0.61: C32.1 109.92,12.61 L4.P$1
N$9
  Top 0.203: IC11.3 110.5,6.29 C33.1
  Top 0.508: IC11.2 109.73,7.24 C33.1
  Top 0.61: L5.P$1 C33.1
N$13  (via drill 0.4)  (1 unrouted)
  Top 0.305: L3.P$2 56.39,24.91 v56.22,24.75
  Power 0.305: 5.61,21.4 20.6,21.4 22.57,19.43 33.49,19.43 38.82,24.76 45.64,24.76 46.19,25.31 55.66,25.31 v56.22,24.75
N$14
  Top 0.203: R35.2 JP7.COM
N$15
  Top 0.406: R5.1 R7.2 38.19,3.9 40.62,6.32 40.62,7 OK1.4 40.7,6.98 41.48,6.98 43.31,8.81 43.31,14.51 42.29,15.53 IC1.6
N$16
  Top 0.406: R3.2 R1.1
N$17
  Top 0.406: R5.2 R3.1
N$18
  Top 0.254: OK2.4 62.88,16.16 62.89,16.18 62.89,13.21 R14.2
N$19
  Top 1.016: R32.2S 86.67,50.53 86.35,50.21 86.35,46.74 86.74,46.35 87.94,46.35 R29.1S R29.1
N$20
  Top 0.406: OK1.3 40.59,9.62 R6.2
N$21
  Top 0.406: IC1.1 39.1,21.88 C2.1 C1.1 36.14,22.39 35.79,22.03 35.79,20.04 38.34,17.48 C4.2 38.93,17.48 39.84,18.4 39.84,19.12 40.06,19.34 IC1.3
N$25
  Top 0.406: IC1.5 39.85,16.8 39.45,16.39 38.16,15.1 37.59,15.67 38.27,15.67 C7.1 C8.1
N$27  (via drill 0.4)
  Top 0.203: IC6.10 87.62,36.65 v86.97,37.3 | v84.06,46.35 R29.2S
  Power 0.203: v84.06,46.35 85.47,46.35 86.97,44.85 v86.97,37.3
N$28
  Top 0.406: IC1.16 C3.1 54.08,20.86 54.08,18.97 53.17,18.07 IC1.13
N$29
  Top 0.406: IC3.6 42.82,32.2 40.56,29.94 C17.1 40.34,28.61 R10.1
N$30
  Bottom 3.81: 94.45,59.47 86.22,59.47 84.09,57.34 F4.1 | 94.45,59.47 ISEL10A_2.11 | 94.45,59.47 ISEL10A_2.21
N$31
  Top 0.406: IC3.1 41.24,38.55 C10.1 C9.1 38.28,39.16 37.88,38.77 37.88,36.45 40.07,34.26 C12.2 41.71,35.34 41.71,35.73 41.99,36.01 IC3.3
N$32
  pour Top (isolate 0.203): 43.57,33.66 39.89,33.66 38.84,34.72 35.13,34.72 34.81,34.4 34.81,32.34 35.27,31.89 40.75,31.89 42.16,33.3 43.57,33.3
N$33
  Top 0.406: IC3.13 55.22,34.74 56.22,35.75 56.22,37.82 C11.1 55.01,38.55 IC3.16
N$37  (via drill 0.4)
  Top 0.254: v31.9,38.97 31.9,29.25 L2.4
  Bottom 0.254: v31.9,38.97 31.9,39.87 28.62,43.15 ISEL10A_1.21
N$44
  Bottom 3.81: F2.1 12.28,19.23 F1.1 12.28,37.88 21.25,46.85 25.5,46.85 28.4,49.75 ISEL10A_1.11
N$55
  Top 0.254: L2.1 29.41,28.14 28.5,27.23 R11.1S
N$56  (via drill 0.4)
  Top 0.203: IC5.14 91.89,15.26 v91.52,15.63 | R21.1 83.43,21.99 v83.48,21.94
  Top 0.305: R22.2 R21.1
  Bottom 0.203: v91.52,15.63 90.21,15.63 83.9,21.94 v83.48,21.94
N$57
  Top 0.254: IC5.6 85.14,11.45 84.47,12.12 72.02,12.12 R15.1
N$59
  Top 0.203: D1.2 101.92,19.93 101.91,19.91 100.19,19.91 100.18,19.92 IC4.7
N$60  (via drill 0.4)
  Top 0.203: D1.1 103.82,20.52 103.57,20.27 v103.57,19.29 | IC4.1 96.23,19.19 v95.89,19.19
  Bottom 0.203: v103.57,19.29 103.47,19.19 v95.89,19.19
N$61
  Top 0.254: R14.1 R15.2
N$63
  Top 0.305: R21.2 R20.1
N$64
  Top 0.305: R18.1 R19.2
N$65
  Top 0.305: R17.1 R18.2
N$67
  Top 0.254: OK2.1 74.11,16.16 R13.2
N$73
  Top 0.203: OK1.1 50.75,7.59 R2.1
N$75
  Top 0.254: R10.2 36.78,29.15 | 36.78,29.15 36.8,29.17 | L2.3 36.69,29.24 36.78,29.15
N$77
  Top 0.406: IC3.7 42.81,30.93 41.66,29.78 41.66,28.23 C17.2 40.32,26.89 38.85,26.89 38.68,26.73 R12.1
N$81
  Top 0.813: Q2.3 Q1.3
N$92
  Top 0.254: C30.2 119.07,20.21 118.3,20.21 117.8,20.71 IC9.28
N$93
  Top 0.254: IC9.30 118.8,20.86 118.99,20.67 120.78,20.67 122.24,19.21 C28.2
N$94
  Top 0.254: C25.2 117.79,35.44 116.8,34.45 IC9.55
  Top 0.406: 117.68,37.2 117.74,37.26 117.74,36.85 C25.2 117.45,37.14 116.18,37.14 C26.1
N$95
  Top 0.254: IC9.26 116.8,21.05 117.97,19.89 C23.2
N$96  (via drill 0.4)
  Top 0.203: IC9.37 120.36,25.88 v120.34,25.87 | JP8.2 124.2,28.38 v124.36,28.22
  Bottom 0.203: v120.34,25.87 122.01,25.87 v124.36,28.22
N$98  (via drill 0.4)
  Top 0.203: 123.84,18.26 R34.1 123.88,18.64 123.88,19.48 v123.84,19.52 | IC9.35 122.78,24.88 v123.53,24.13
  Bottom 0.203: 123.72,19.63 v123.84,19.52 123.53,19.82 v123.53,24.13
N$100
  Top 0.61: C27.2 115.25,44.72 R33.1
N$137
  Top 0.508: IC2.10 37.08,65.94 ZD1.C
N$154  (via drill 0.4)
  Top 0.254: JP1.2 v61.16,42.13
  Power 0.254: v61.16,42.13 61.16,8.95 57.08,4.87 X2.23
N$155
  Top 0.254: X2.25 54.54,4.78 JP3.2
N$156  (via drill 0.4)
  Top 0.254: v78.65,37.11 79.75,37.34 JP2.1
  Power 0.254: X2.24 58.36,3.24 58.36,5.46 61.62,8.72 61.62,36.38 v61.9,36.66
  Bottom 0.254: v78.65,37.11 62.56,37.11 v61.9,36.66
N$157
  Top 0.254: X2.26 55.84,3.26 55.84,5.06 57.75,6.97 61.9,6.97 JP4.1
N$170
  Top 0.813: R29.2 82.87,46.21 82.87,44.31 83.84,43.33 86.26,43.33 R27.1 86.42,42.5 86.42,39.47 87.02,38.87 Q2.2
N$173
  Top 0.254: R31.2 99.34,38.01 D9.2
  Top 1.016: D7.2 D8.1 D9.2 D6.1
N$182  (via drill 0.4)
  Top 0.203: v82.55,36.75 82.55,34.98 IC6.14
  Top 0.254: R30.2 99.15,32.14 v99.54,32.53 | Q1.2 v90.27,38.87
  Top 0.813: ISEL1A_1.5 v67.08,35.63 ISEL1A_1.8 | R27.2 v90.64,42.83
  Top 1.016: D7.1 D6.2 v99.54,32.53
  Bottom 0.203: 82.5,35.63 82.5,36.7 v82.55,36.75
  Bottom 0.254: 82.55,35.67 82.5,35.63
  Bottom 0.813: 90.58,35.63 90.27,35.94 v90.27,38.87 90.27,42.47 v90.64,42.83
  Bottom 1.016: v67.08,35.63 82.5,35.63 90.58,35.63 96.44,35.63 v99.54,32.53
N$183
  Top 0.254: R31.1 94.72,36.1 IC7.4 94.5,36.04 92.75,34.29 IC7.1
N$184
  Top 0.254: R30.1 94.81,34.04 94.64,34.21 94.64,33.66 IC7.3
N$199
  Top 0.203: IC4.8 102.75,24.88 D10.2
N$200  (via drill 0.4)
  Top 0.203: IC4.14 v95.87,24.88 | v101.21,23.78 101.94,23.78 D10.1
  Bottom 0.203: v95.87,24.88 100.11,24.88 v101.21,23.78
USEL1#3  (via drill 0.4)
  Top 0.203: R13.1 74.34,18.29 v75.3,18.29 | IC5.8 76.83,8.91 v75.3,10.45
  Power 0.203: v70.51,55.9 70.8,55.61 70.8,44.69 74.89,40.6 74.89,18.64 75.25,18.29 v75.3,18.29 v75.3,10.45
  Bottom 0.203: X3.11 73.61,65.25 73.61,62.98 72.75,62.11 72.75,57.38 71.27,55.9 v70.51,55.9
USEL20#3  (via drill 0.4)
  Top 0.203: IC5.1 v87.77,20.06
  Power 0.203: v71.16,56.87 71.26,56.77 71.26,44.88 75.35,40.79 75.35,26.38 78.14,23.58 84.37,23.58 87.77,20.18 v87.77,20.06
  Bottom 0.203: X3.13 71.06,65.26 71.06,56.97 v71.16,56.87
USEL100#3  (via drill 0.4)
  Top 0.203: IC5.16 93.15,24.53 90.11,27.58 79.53,27.58 v78.72,28.39
  Power 0.203: v72.19,55.72 72.19,44.61 76.56,40.24 76.56,30.55 v78.72,28.39
  Bottom 0.203: X3.9 76.12,65.28 76.12,62.72 73.38,59.98 73.38,56.92 v72.19,55.72
USEL#1  (via drill 0.4)
  Top 0.203: v52.95,10.45 R2.2
  Power 0.203: X3.5 78.66,65.26 78.66,62.45 77.22,61.01 71.51,61.01 59.08,48.57 59.08,44.24 58.4,43.56 58.4,42.92 58.55,42.76 59.07,42.25 59.08,42.24 59.08,23.35 52.95,17.22 v52.95,10.45
VREFP  (via drill 0.4)
  Top 0.203: IC8.6 117.84,42.41 C27.1
  Top 0.254: IC9.24 115.8,20.42 C29.1 114.53,18.57 113.69,17.72 113.1,17.72 C31.1 v112.06,17.1
  Top 0.406: IC8.7 117.5,41.76 | 117.5,41.76 C27.1 | 117.5,41.76 117.25,41.76 v116.32,40.83
  Bottom 0.305: v112.06,17.1 109.69,19.48 109.69,27.81 109.04,28.46 109.04,38.58 111.29,40.83 v116.32,40.83
(copper drawn outside any net)
  shapes: Power area x16

## Text on the board
tPlace: EEZ DIB AFE3 / (08/2021 r1B4)
bPlace: Project source code: github.com/eez-open | EEZ DIB AFE3 / (08/2021 r1B4) | AIN4+ / / / AIN4- | AIN3+ / / / AIN3- | AIN2+ / / / AIN2- | ISO_I | AIN1+ / / / AIN1- | ISO_U